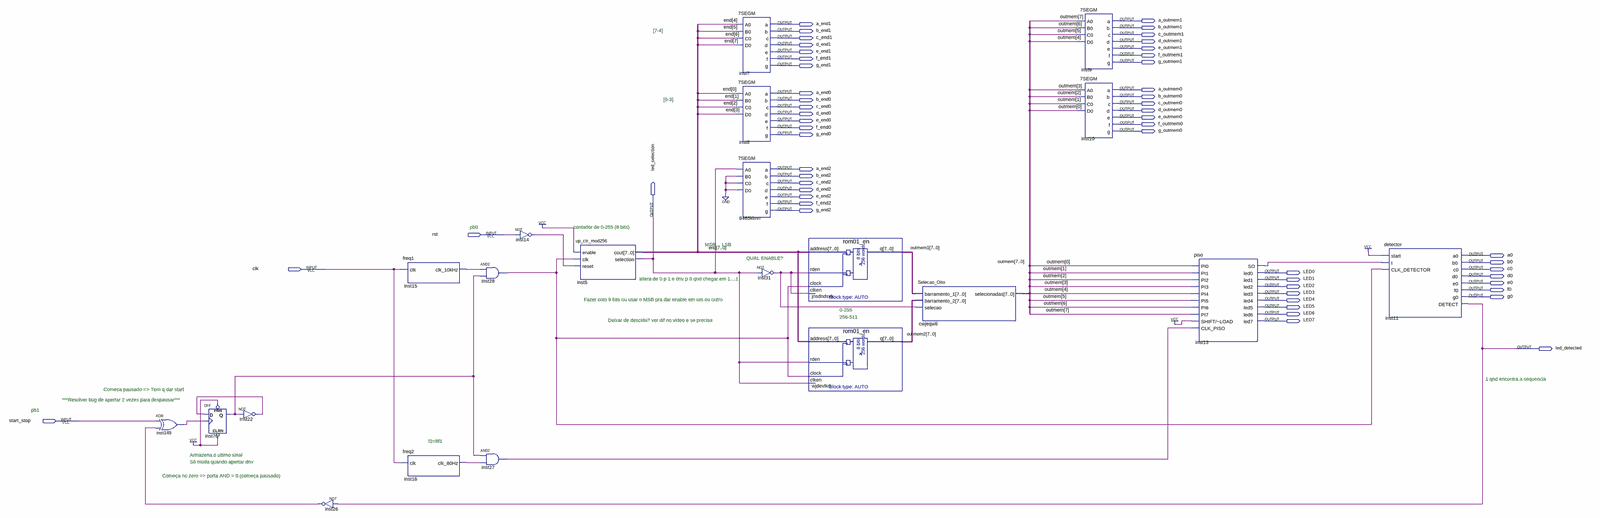
[diagram p0: schematic sheet, whole]
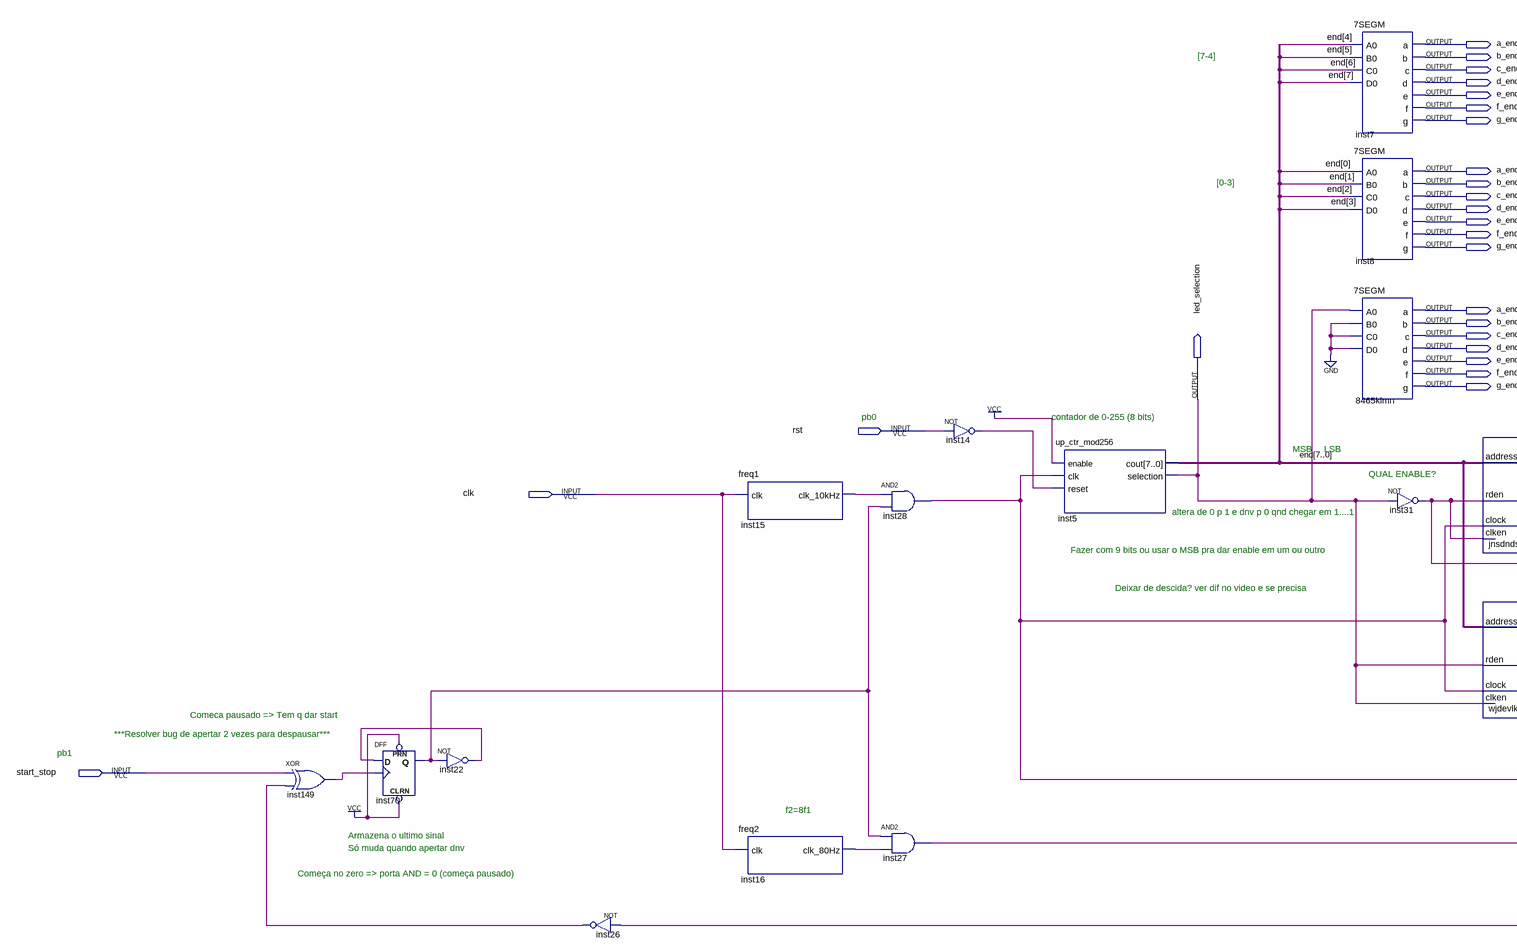
[diagram p1: schematic sheet, left part]
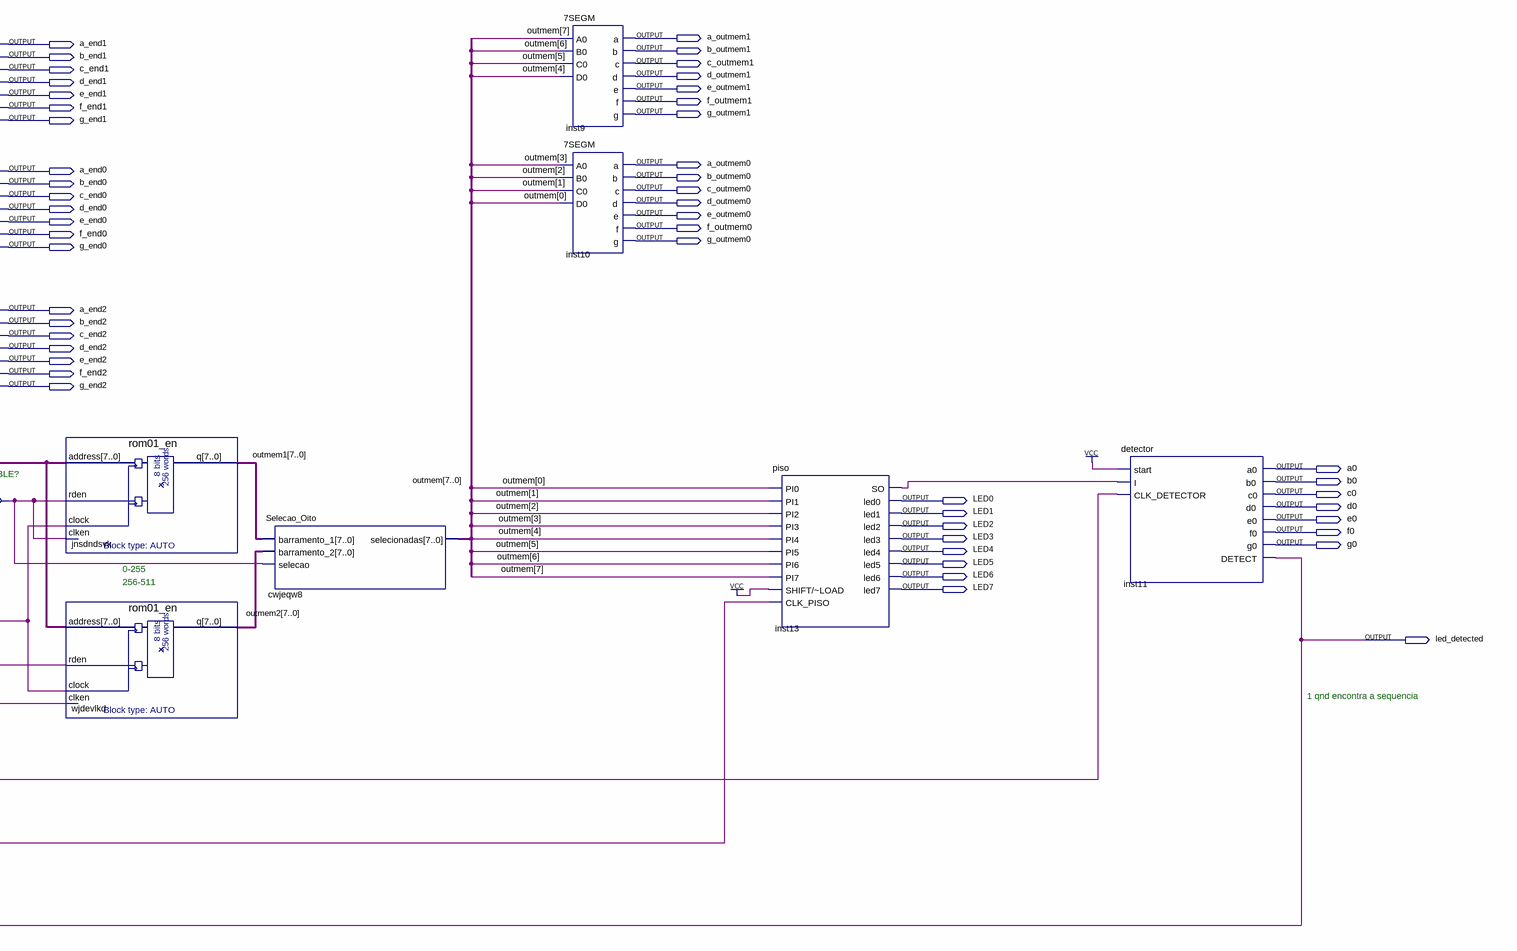
[diagram p2: schematic sheet, right part]
// Quartus schematic memoblock.bdf as structural Verilog: 21 symbols, 55 pins
module memoblock (
  input  rst,
  input  clk,
  input  start_stop,
  output a_outmem1,
  output a_end1,
  output b_outmem1,
  output b_end1,
  output c_outmem1,
  output c_end1,
  output d_outmem1,
  output d_end1,
  output e_outmem1,
  output e_end1,
  output f_outmem1,
  output f_end1,
  output g_outmem1,
  output g_end1,
  output a_outmem0,
  output a_end0,
  output b_outmem0,
  output b_end0,
  output c_outmem0,
  output c_end0,
  output d_outmem0,
  output d_end0,
  output e_outmem0,
  output e_end0,
  output f_outmem0,
  output f_end0,
  output g_outmem0,
  output g_end0,
  output a_end2,
  output b_end2,
  output c_end2,
  output d_end2,
  output e_end2,
  output f_end2,
  output g_end2,
  output led_selection,
  output a0,
  output b0,
  output c0,
  output LED0,
  output d0,
  output LED1,
  output e0,
  output LED2,
  output f0,
  output LED3,
  output g0,
  output LED4,
  output LED5,
  output LED6,
  output LED7,
  output led_detected
);

  wire inst13_so, inst14_out, inst15_clk_10khz, inst16_clk_80hz, inst22_out, inst26_out, inst27_out,
       inst28_out, inst31_out, inst70_q, inst149_out;
  wire [7:0] \end , outmem, outmem1, outmem2;

  xor inst149 (inst149_out, start_stop, inst26_out);
  DFF inst70 (.CLRN(1'b1), .CLK(inst149_out), .D(inst22_out), .PRN(1'b1), .Q(inst70_q));
  not inst22 (inst22_out, inst70_q);
  not inst26 (inst26_out, led_detected);
  freq1 inst15 (.clk(clk), .clk_10kHz(inst15_clk_10khz));
  freq2 inst16 (.clk(clk), .clk_80Hz(inst16_clk_80hz));
  and inst28 (inst28_out, inst15_clk_10khz, inst70_q);
  and inst27 (inst27_out, inst70_q, inst16_clk_80hz);
  not inst14 (inst14_out, rst);
  up_ctr_mod256 inst5 (.enable(1'b1), .clk(inst28_out), .reset(inst14_out), .cout(\end ), .selection(led_selection));
  \7SEGM  inst7 (
    .A0(\end [4]), .B0(\end [5]), .C0(\end [6]), .D0(\end [7]), .a(a_end1), .b(b_end1), .c(c_end1),
    .d(d_end1), .e(e_end1), .f(f_end1), .g(g_end1));
  \7SEGM  inst8 (
    .A0(\end [0]), .B0(\end [1]), .C0(\end [2]), .D0(\end [3]), .a(a_end0), .b(b_end0), .c(c_end0),
    .d(d_end0), .e(e_end0), .f(f_end0), .g(g_end0));
  \7SEGM  u_8465klmn (
    .A0(led_selection), .B0(1'b0), .C0(1'b0), .D0(1'b0), .a(a_end2), .b(b_end2), .c(c_end2), .d(d_end2),
    .e(e_end2), .f(f_end2), .g(g_end2));
  not inst31 (inst31_out, led_selection);
  rom01_en jnsdndsvk (.address(\end ), .rden(inst31_out), .clock(inst28_out), .clken(inst31_out), .q(outmem1));
  rom01_en wjdevlkd (.address(\end ), .rden(led_selection), .clock(inst28_out), .clken(led_selection), .q(outmem2));
  Selecao_Oito cwjeqw8 (.barramento_1(outmem1), .barramento_2(outmem2), .selecao(inst31_out), .selecionadas(outmem));
  \7SEGM  inst9 (
    .A0(outmem[7]), .B0(outmem[6]), .C0(outmem[5]), .D0(outmem[4]), .a(a_outmem1), .b(b_outmem1),
    .c(c_outmem1), .d(d_outmem1), .e(e_outmem1), .f(f_outmem1), .g(g_outmem1));
  \7SEGM  inst10 (
    .A0(outmem[3]), .B0(outmem[2]), .C0(outmem[1]), .D0(outmem[0]), .a(a_outmem0), .b(b_outmem0),
    .c(c_outmem0), .d(d_outmem0), .e(e_outmem0), .f(f_outmem0), .g(g_outmem0));
  piso inst13 (
    .PI0(outmem[0]), .PI1(outmem[1]), .PI2(outmem[2]), .PI3(outmem[3]), .PI4(outmem[4]), .PI5(outmem[5]),
    .PI6(outmem[6]), .PI7(outmem[7]), .\SHIFT/~LOAD (1'b1), .CLK_PISO(inst27_out), .SO(inst13_so),
    .led0(LED0), .led1(LED1), .led2(LED2), .led3(LED3), .led4(LED4), .led5(LED5), .led6(LED6), .led7(LED7));
  detector inst11 (
    .start(1'b1), .I(inst13_so), .CLK_DETECTOR(inst28_out), .a0(a0), .b0(b0), .c0(c0), .d0(d0), .e0(e0),
    .f0(f0), .g0(g0), .DETECT(led_detected));

  // Notes on the sheet:
  //   [7-4]
  //   [0-3]
  //   pb0
  //   contador de 0-255 (8 bits)
  //   MSB
  //   LSB
  //   QUAL ENABLE?
  //   altera de 0 p 1 e dnv p 0 qnd chegar em 1....1
  //   Fazer com 9 bits ou usar o MSB pra dar enable em um ou outro
  //   0-255
  //   256-511
  //   Deixar de descida? ver dif no video e se precisa
  //   1 qnd encontra a sequencia
  //   Comeca pausado => Tem q dar start
  //   ***Resolver bug de apertar 2 vezes para despausar***
  //   pb1
  //   f2=8f1
  //   Armazena o ultimo sinal
  //   Só muda quando apertar dnv
  //   Começa no zero => porta AND = 0 (começa pausado)
endmodule
